# EAGLE design USB-Weather-v31 (EAGLE 5.11)
SFENUM: VREG-9872

## Sheet 1 of 2
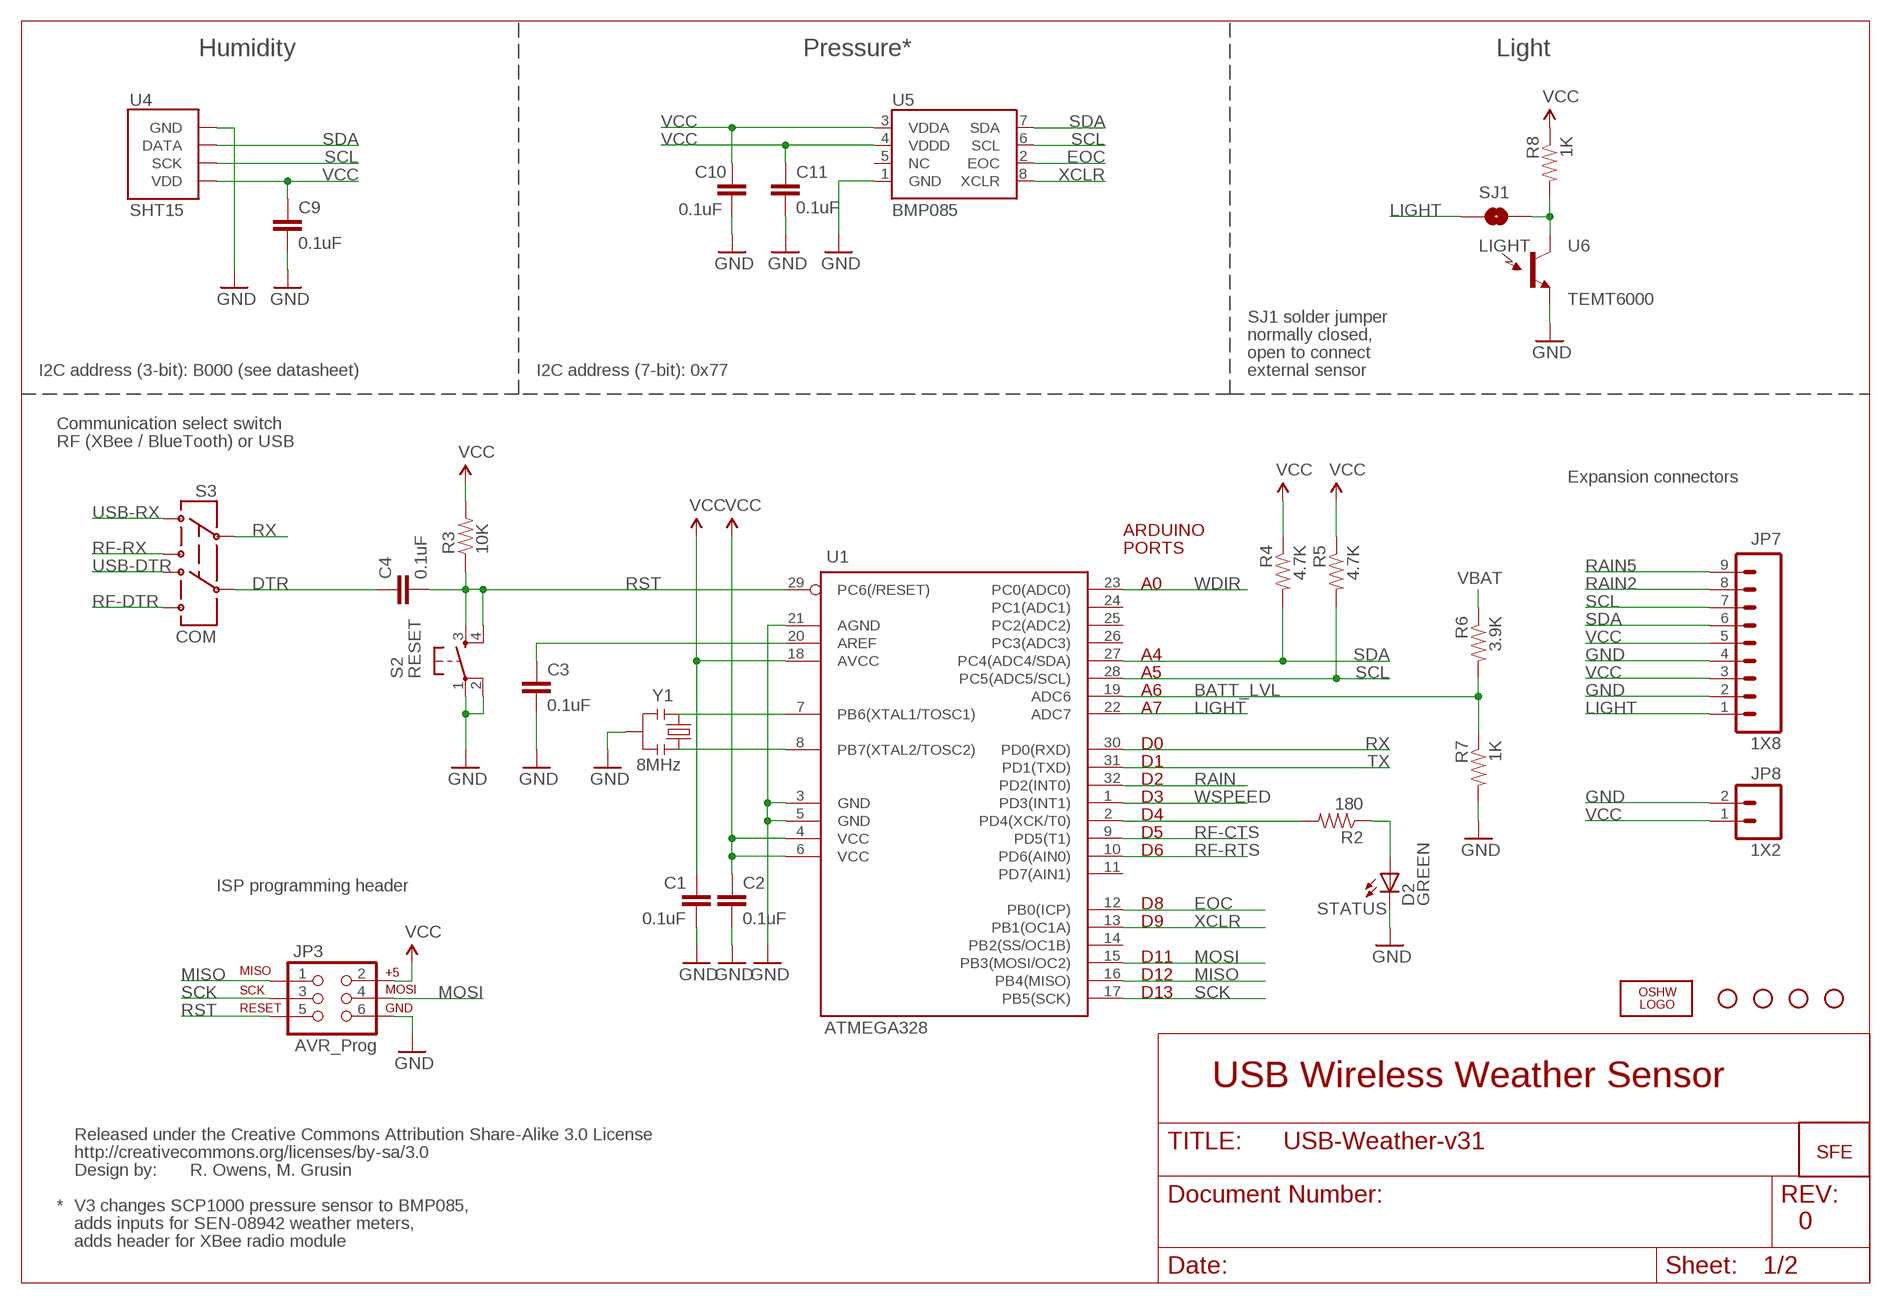
[diagram p0: schematic, sheet 1]

### Parts
C1  0.1uF  CAP0402-CAP  [0402-CAP]
C2  0.1uF  CAP0402-CAP  [0402-CAP]
C3  0.1uF  CAP0402-CAP  [0402-CAP]
C4  0.1uF  CAP0402-CAP  [0402-CAP]
C9  0.1uF  CAP0402-CAP  [0402-CAP]
C10  0.1uF  CAP0402-CAP  [0402-CAP]
C11  0.1uF  CAP0402-CAP  [0402-CAP]
D2  GREEN  LED0603  [LED-0603]
JP3  AVR_Prog  AVR_SPI_PRG_6PTH  [2X3]
JP7  1X8  M09  [1X09]
JP8  1X2  M02PTH  [1X02]
LOGO1  OSHW_LOGO_FILLX0100-NT  [OSHW_FILLX100_NOTEXT]
R2  180  RESISTOR0402-RES  [0402-RES]
R3  10K  RESISTOR0402-RES  [0402-RES]
R4  4.7K  RESISTOR0402-RES  [0402-RES]
R5  4.7K  RESISTOR0402-RES  [0402-RES]
R6  3.9K  RESISTOR0402-RES  [0402-RES]
R7  1K  RESISTOR0402-RES  [0402-RES]
R8  1K  RESISTOR0402-RES  [0402-RES]
S2  RESET  TAC_SWITCHSMD  [TACTILE_SWITCH_SMD]
S3  COM  SWITCH-DPDTSMD  [AYZ0202]
SJ1  LIGHT  SOLDERJUMPERNC  [SJ_2S]
U1  ATMEGA328  AVR-MEGA8-AI  [TQFP32-08]
U4  SHT15  SHT1XSMD  [SHT1X]
U5  BMP085  [BMP085]
U6  TEMT6000  [TEMT6000-SEN]
U$1  LOGO-SFENEW  [SFE-NEW-WEBLOGO]
U$2  STAND-OFF  [STAND-OFF]
U$3  STAND-OFF  [STAND-OFF]
U$4  STAND-OFF  [STAND-OFF]
U$5  STAND-OFF  [STAND-OFF]
U$6  CREATIVE_COMMONS  [CREATIVE_COMMONS]
Y1  8MHz  RESONATORSMD  [RESONATOR-SMD]

### Nets
BATT_LVL: R6.2 R7.1 U1.19(ADC6)
DTR: C4.1 S3.5
EOC: U1.12(PB0(ICP)) U5.2(EOC)
GND: C1.2 C2.2 C3.2 C9.2 C10.1 C11.2 D2.C JP3.6 JP7.2 JP7.4 JP8.2 R7.2 S2.1 S2.2 U1.3(GND) U1.5(GND) U1.21(AGND) U4.1(GND) U5.1(GND) U6.EMITTER(E1) Y1.2 ; also sheet 2
LIGHT: JP7.1 SJ1.1 U1.22(ADC7)
MISO: JP3.1 U1.16(PB4(MISO))
MOSI: JP3.4 U1.15(PB3(MOSI/OC2))
N$4: R2.2 U1.2(PD4(XCK/T0))
N$5: D2.A R2.1
N$8: C3.1 U1.20(AREF)
N$9: R8.2 SJ1.2 U6.COLLECTOR(C1)
N$10: U1.7(PB6(XTAL1/TOSC1)) Y1.1
N$14: U1.8(PB7(XTAL2/TOSC2)) Y1.3
RAIN: U1.32(PD2(INT0)) ; also sheet 2
RAIN2: JP7.8 ; also sheet 2
RAIN5: JP7.9 ; also sheet 2
RF-CTS: U1.9(PD5(T1)) ; also sheet 2
RF-DTR: S3.6 ; also sheet 2
RF-RTS: U1.10(PD6(AIN0)) ; also sheet 2
RF-RX: S3.3 ; also sheet 2
RST: C4.2 JP3.5 R3.1 S2.3 S2.4 U1.29(PC6(/RESET))
RX: S3.2 U1.30(PD0(RXD))
SCK: JP3.3 U1.17(PB5(SCK))
SCL: JP7.7 R5.2 U1.28(PC5(ADC5/SCL)) U4.3(SCK) U5.6(SCL)
SDA: JP7.6 R4.2 U1.27(PC4(ADC4/SDA)) U4.2(DATA) U5.7(SDA)
TX: U1.31(PD1(TXD)) ; also sheet 2
USB-DTR: S3.4 ; also sheet 2
USB-RX: S3.1 ; also sheet 2
VBAT: R6.1 ; also sheet 2
VCC: C1.1 C2.1 C9.1 C10.2 C11.1 JP3.2 JP7.3 JP7.5 JP8.1 R3.2 R4.1 R5.1 R8.1 U1.4(VCC) U1.6(VCC) U1.18(AVCC) U4.4(VDD) U5.3(VDDA) U5.4(VDDD) ; also sheet 2
WDIR: U1.23(PC0(ADC0)) ; also sheet 2
WSPEED: U1.1(PD3(INT1)) ; also sheet 2
XCLR: U1.13(PB1(OC1A)) U5.8(XCLR)
Unconnected: U1.11(PD7(AIN1)) U1.14(PB2(SS/OC1B)) U1.24(PC1(ADC1)) U1.25(PC2(ADC2)) U1.26(PC3(ADC3)) U5.5(NC)

### Notes on the sheet
- Humidity | Pressure* | Light
- SJ1 solder jumper
- normally closed,
- open to connect
- I2C address (3-bit): B000 (see datasheet) | I2C address (7-bit): 0x77 | external sensor
- Communication select switch
- RF (XBee / BlueTooth) or USB
- Expansion connectors
- ARDUINO
- PORTS
- A0
- A4
- A5
- A6
- A7
- D0
- D1
- D2
- D3
- D4
- D5
- D6
- ISP programming header
- D8
- STATUS
- D9
- D11
- D12
- D13
- USB Wireless Weather Sensor
- R. Owens, M. Grusin
- * | V3 changes SCP1000 pressure sensor to BMP085,
- adds inputs for SEN-08942 weather meters, | 0
- adds header for XBee radio module

## Sheet 2 of 2
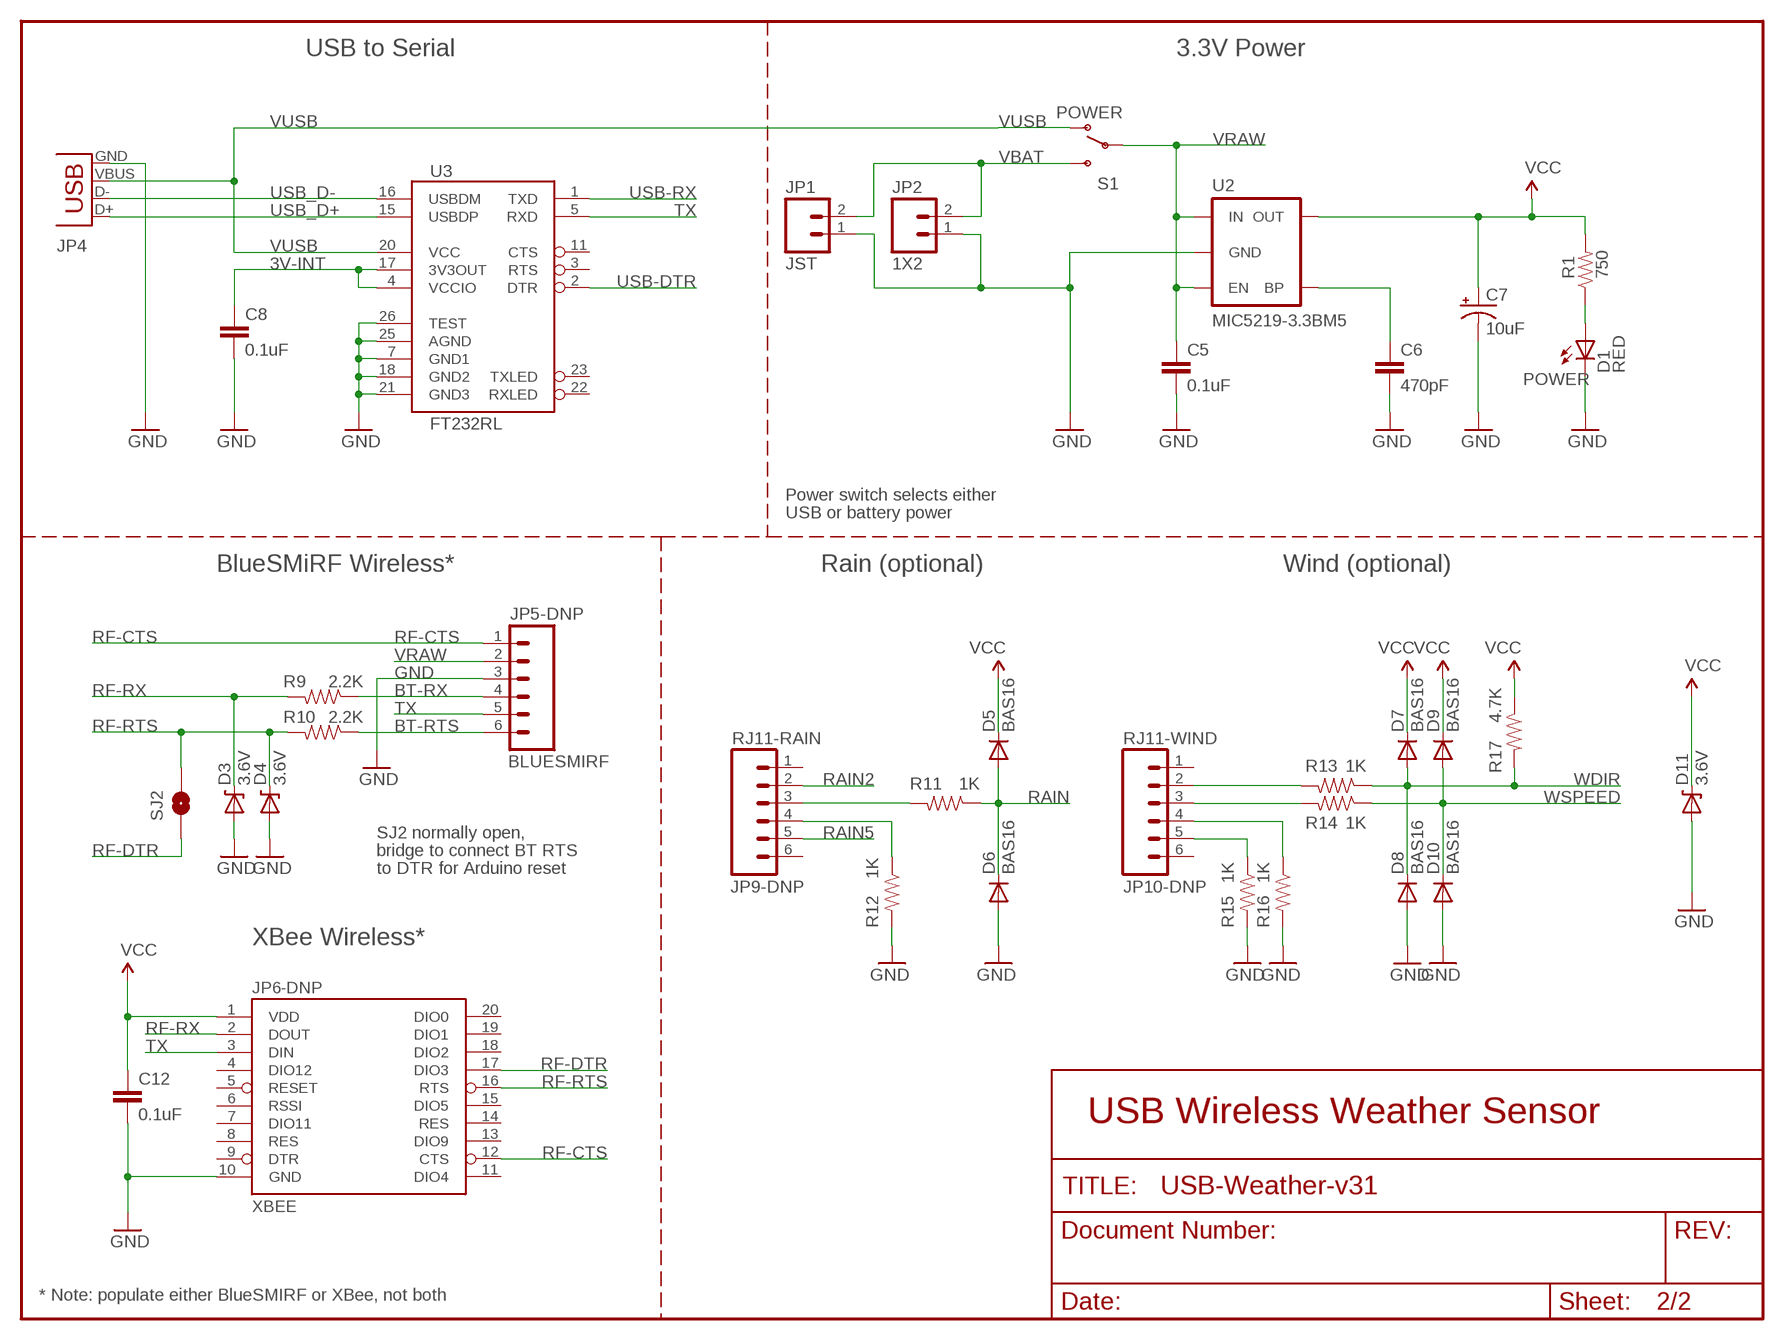
[diagram p1: schematic, sheet 2]

### Parts
C5  0.1uF  CAP0402-CAP  [0402-CAP]
C6  470pF  CAP0402-CAP  [0402-CAP]
C7  10uF  CAP_POL1206  [EIA3216]
C8  0.1uF  CAP0402-CAP  [0402-CAP]
C12  0.1uF  CAP0402-CAP  [0402-CAP]
D1  RED  LED0603  [LED-0603]
D3  3.6V  DIODE-ZENER-BZT52  [SOD-323]
D4  3.6V  DIODE-ZENER-BZT52  [SOD-323]
D5  BAS16  DIODESOD  [SOD-323]
D6  BAS16  DIODESOD  [SOD-323]
D7  BAS16  DIODESOD  [SOD-323]
D8  BAS16  DIODESOD  [SOD-323]
D9  BAS16  DIODESOD  [SOD-323]
D10  BAS16  DIODESOD  [SOD-323]
D11  3.6V  DIODE-ZENER-BZT52  [SOD-323]
JP1  JST  M02-JST-2MM-SMT  [JST-2-SMD]
JP2  1X2  M021X02_NO_SILK  [1X02_NO_SILK]
JP4  USBSMD  [USB-MINIB]
JP5-DNP  BLUESMIRF  M06SIP  [1X06]
JP6-DNP  XBEE  XBEE-1B1  [XBEE-1]
JP9-DNP  RJ11-RAIN  RJ11-6PTH  [RJ11-6]
JP10-DNP  RJ11-WIND  RJ11-6PTH  [RJ11-6]
R1  750  RESISTOR0402-RES  [0402-RES]
R9  2.2K  RESISTOR0402-RES  [0402-RES]
R10  2.2K  RESISTOR0402-RES  [0402-RES]
R11  1K  RESISTOR0402-RES  [0402-RES]
R12  1K  RESISTOR0402-RES  [0402-RES]
R13  1K  RESISTOR0402-RES  [0402-RES]
R14  1K  RESISTOR0402-RES  [0402-RES]
R15  1K  RESISTOR0402-RES  [0402-RES]
R16  1K  RESISTOR0402-RES  [0402-RES]
R17  4.7K  RESISTOR0402-RES  [0402-RES]
S1  POWER  SWITCH-SPSTSMD  [AYZ0202]
SJ2  SOLDERJUMPERNO  [SJ_2S-NO]
U2  MIC5219-3.3BM5  V_REG_LDOSMD  [SOT23-5]
U3  FT232RL  FT232RL-BASICSSOP  [SSOP28DB]

### Nets
3V-INT: C8.1 U3.4(VCCIO) U3.17(3V3OUT)
BT-RTS: JP5-DNP.6 R10.1
BT-RX: JP5-DNP.4 R9.1
GND: C5.2 C6.2 C7.C(-) C8.2 C12.2 D1.C D3.2(A) D4.2(A) D6.2(A) D8.2(A) D10.2(A) D11.2(A) JP1.1 JP2.1 JP4.GND JP5-DNP.3 JP6-DNP.10(GND) R12.2 R15.2 R16.2 U2.2(GND) U3.7(GND1) U3.18(GND2) U3.21(GND3) U3.25(AGND) U3.26(TEST) ; also sheet 1
N$1: D1.A R1.1
N$2: JP10-DNP.2 R13.2
N$3: JP10-DNP.3 R14.2
N$6: C6.1 U2.4(BP)
N$7: JP9-DNP.3 R11.2
N$11: JP9-DNP.4 R12.1
N$12: JP10-DNP.5 R15.1
N$13: JP10-DNP.4 R16.1
RAIN: D5.2(A) D6.1(C) R11.1 ; also sheet 1
RAIN2: JP9-DNP.2 ; also sheet 1
RAIN5: JP9-DNP.5 ; also sheet 1
RF-CTS: JP5-DNP.1 JP6-DNP.12(CTS) ; also sheet 1
RF-DTR: JP6-DNP.17(DIO3) SJ2.1 ; also sheet 1
RF-RTS: D4.1(C) JP6-DNP.16(RTS) R10.2 SJ2.2 ; also sheet 1
RF-RX: D3.1(C) JP6-DNP.2(DOUT) R9.2 ; also sheet 1
TX: JP5-DNP.5 JP6-DNP.3(DIN) U3.5(RXD) ; also sheet 1
USB-DTR: U3.2(DTR) ; also sheet 1
USB-RX: U3.1(TXD) ; also sheet 1
USB_D+: JP4.D+ U3.15(USBDP)
USB_D-: JP4.D- U3.16(USBDM)
VBAT: JP1.2 JP2.2 S1.3(S) ; also sheet 1
VCC: C7.A(+) C12.1 D5.1(C) D7.1(C) D9.1(C) D11.1(C) JP6-DNP.1(VDD) R1.2 R17.1 U2.5(OUT) ; also sheet 1
VRAW: C5.1 JP5-DNP.2 S1.2(P) U2.1(IN) U2.3(EN)
VUSB: JP4.VBUS S1.1(O) U3.20(VCC)
WDIR: D7.2(A) D8.1(C) R13.1 R17.2 ; also sheet 1
WSPEED: D9.2(A) D10.1(C) R14.1 ; also sheet 1
Unconnected: JP6-DNP.4(DIO12) JP6-DNP.5(RESET) JP6-DNP.6(RSSI) JP6-DNP.7(DIO11) JP6-DNP.8(RES) JP6-DNP.9(DTR) JP6-DNP.11(DIO4) JP6-DNP.13(DIO9) JP6-DNP.14(RES) JP6-DNP.15(DIO5) JP6-DNP.18(DIO2) JP6-DNP.19(DIO1) JP6-DNP.20(DIO0) JP9-DNP.1 JP9-DNP.6 JP10-DNP.1 JP10-DNP.6 U3.3(RTS) U3.11(CTS) U3.22(RXLED) U3.23(TXLED)

### Notes on the sheet
- USB to Serial | 3.3V Power
- JP4
- POWER
- Power switch selects either
- USB or battery power
- Rain (optional) | Wind (optional)
- BlueSMiRF Wireless*
- SJ2 normally open,
- bridge to connect BT RTS
- to DTR for Arduino reset
- XBee Wireless*
- USB Wireless Weather Sensor
- * Note: populate either BlueSMIRF or XBee, not both

## Library data of the parts
C1-C6 C8-C12 = SparkFun:CAP: Capacitor Standard 0603 ceramic capacitor, and 0.1" leaded capacitor.
C7 = SparkFun:CAP_POL: Capacitor Polarized These are standard SMD and PTH capacitors. Normally 10uF, 47uF, and 100uF in electrolytic and tantalum varieties. Always verify the external diameter of the through hole cap, it varies with capacity, voltage, and manufacturer. The EIA devices should be standard.
D1 D2 = SparkFun:LED: LEDs Standard schematic elements and footprints for 5mm, 3mm, 1206, and 0603 sized LEDs. 5mm - Spark Fun Electronics SKU : COM-00529 (and others)
D3 D4 D11 = SparkFun:DIODE-ZENER: Zener Diode Production Part - 8199 3.4V Zener Voltage
D5-D10 = SparkFun:DIODE: Diode These are standard reverse protection diodes and small signal diodes. SMA package can handle up to about 1A. SOD-323 can handle about 200mA. What the SOD-323 package when ordering, there are some mfgs out there that are 5-pin packages.
JP1 JP2 JP8 = SparkFun:M02: Header 2 Standard 2-pin 0.1" header. Use with straight break away headers (SKU : PRT-00116), right angle break away headers (PRT-00553), swiss pins (PRT-00743), machine pins (PRT-00117), and female headers (PRT-00115). Molex polarized connector foot print use with SKU : PRT-08233 with associated crimp pins and housings.
JP3 = SparkFun:AVR_SPI_PRG_6: AVR ISP 6 Pin This is the reduced ISP connector for AVR programming. Common on Arduino. This footprint will take up less PCB space and can be used with a 10-pin to 6-pin adapter such as SKU: BOB-08508
JP4 = SparkFun:USB: USB Connectors USB-B-PTH is fully proven SKU : PRT-00139 USB-miniB is fully proven SKU : PRT-00587 USB-A-PCB is untested. USB-A-H is throughly reviewed, but untested. Spark Fun Electronics SKU : PRT-00437 USB-B-SMT is throughly reviewed, but untested. Needs silkscreen touching up. USB-A-S has not been used/tested USB-MB-H has not been used/tested
JP5-DNP = SparkFun:M06: Header 6 Standard 6-pin 0.1" header. Use with straight break away headers (SKU : PRT-00116), right angle break away headers (PRT-00553), swiss pins (PRT-00743), machine pins (PRT-00117), and female headers (PRT-00115). Molex polarized connector foot print use with SKU : PRT-08094 with associated crimp pins and housings. NOTES ON THE VARIANTS LOCK and LOCK_LONGPADS... This footprint was designed to help hold the alignment of a through-hole component (i.e. 6-pin header) while soldering it into place. You may notice that each hole has been shifted either up or down by 0.005 of an inch from it's more standard position (which is a perfectly straight line). This slight alteration caused the pins (the squares in the middle) to touch the edges of the holes. Because they are alternating, it causes a "brace" to hold the component in place. 0.005 has proven to be the perfect amount of "off-center" position when using our standard breakaway headers. Although looks a little odd when you look at the bare footprint, once you have a header in there, the alteration is very hard to notice. Also, if you push a header all the way into place, it is covered up entirely on the bottom side. This idea of altering the position of holes to aid alignment will be further integrated into the Sparkfun Library for other footprints. It can help hold any component with 3 or more connection pins.
JP6-DNP = SparkFun:XBEE-1
JP7 = SparkFun:M09: Header 9 Standard 9-pin 0.1" header. Use with straight break away headers (SKU : PRT-00116), right angle break away headers (PRT-00553), swiss pins (PRT-00743), machine pins (PRT-00117), and female headers (PRT-00115).
JP9-DNP JP10-DNP = SparkFun:RJ11-6: RJ11 Jack Simple 6 pin RJ11 jack. Commonly found on CAT3 devices and Microchip programmers. SKU: PRT-00132
LOGO1 = OSHW:OSHW_LOGO_FILL
R1-R17 = SparkFun:RESISTOR: Resistor Basic schematic elements and footprints for 0603, 1206, and PTH resistors.
S1 = SparkFun:SWITCH-SPST: SPST Switch Simple slide switch. Spark Fun Electronics SKU : COM-00102
S2 = SparkFun:TAC_SWITCH: Momentary Switch Button commonly used for reset or general input. Spark Fun Electronics SKU : COM-00097
S3 = SparkFun:SWITCH-DPDT: DPDT Version of the COM-00597
SJ1 SJ2 = SparkFun:SOLDERJUMPER: Solder Jumper Standard SMD solder jumper. Used to automate production. Two varients : Normally Open and Normally Closed are the same, but have different paste layers. NC will have a large amount of paste and should jumper during reflow.
U1 = SparkFun:AVR-MEGA8: MICROCONTROLLER 8 Kbytes FLASH 1 kbytes SRAM 512 bytes EEPROM USART 6-channel 10 bit ADC 2-channel 8 bit ADC
U2 = SparkFun:V_REG_LDO: Voltage Regulator LDO Standard 150mA LDO voltage regulator in SOT-23 layout. Micrel part MIC5205. BP (by-pass) pin is used to lower output noise with 470pF cap.
U3 = SparkFun:FT232RL-BASIC: USB UART This is the simplified version of the FT232RL unit. Only what you need, nothing you don't. Spark Fun Electronics SKU : COM-00650
U4 = SparkFun:SHT1X: SHT1x Humdity Sensor Sensirion humdity sensor. Schematic element and footprint proven. Spark Fun Electronics SKU : COM-08227
U5 = SparkFun:BMP085: BMP085 Pressure Sensor Great little MEMS pressure sensor. SKU: COM-09603
U6 = SparkFun:TEMT6000: Ambient Light Sensor Simple light detection sensor. Output varies with light intensity input. Spark Fun Electronics SKU : COM-08348
U$1 = SparkFun:LOGO-SFE: Spark Fun Electronics PCB Logo This is the standard Spark Fun Electronics PCB logo.
U$2-U$5 = SparkFun:STAND-OFF: Stand Off This is the mechanical footprint for a #4 phillips button head screw. Use the keepout ring to avoid running the screw head into surrounding components. SKU : PRT-00447
U$6 = SparkFun:CREATIVE_COMMONS
Y1 = SparkFun:RESONATOR: Resonator Small SMD resonator. This is the itty bitty 10/20MHz resonators with built in caps. CSTCE10M0G55 and CSTCE20M0V53. Footprint has been reviewed closely but hasn't been tested yet.

## Net classes
0 Default: width 0.203 mm
1 Power: width 0.305 mm

## Board
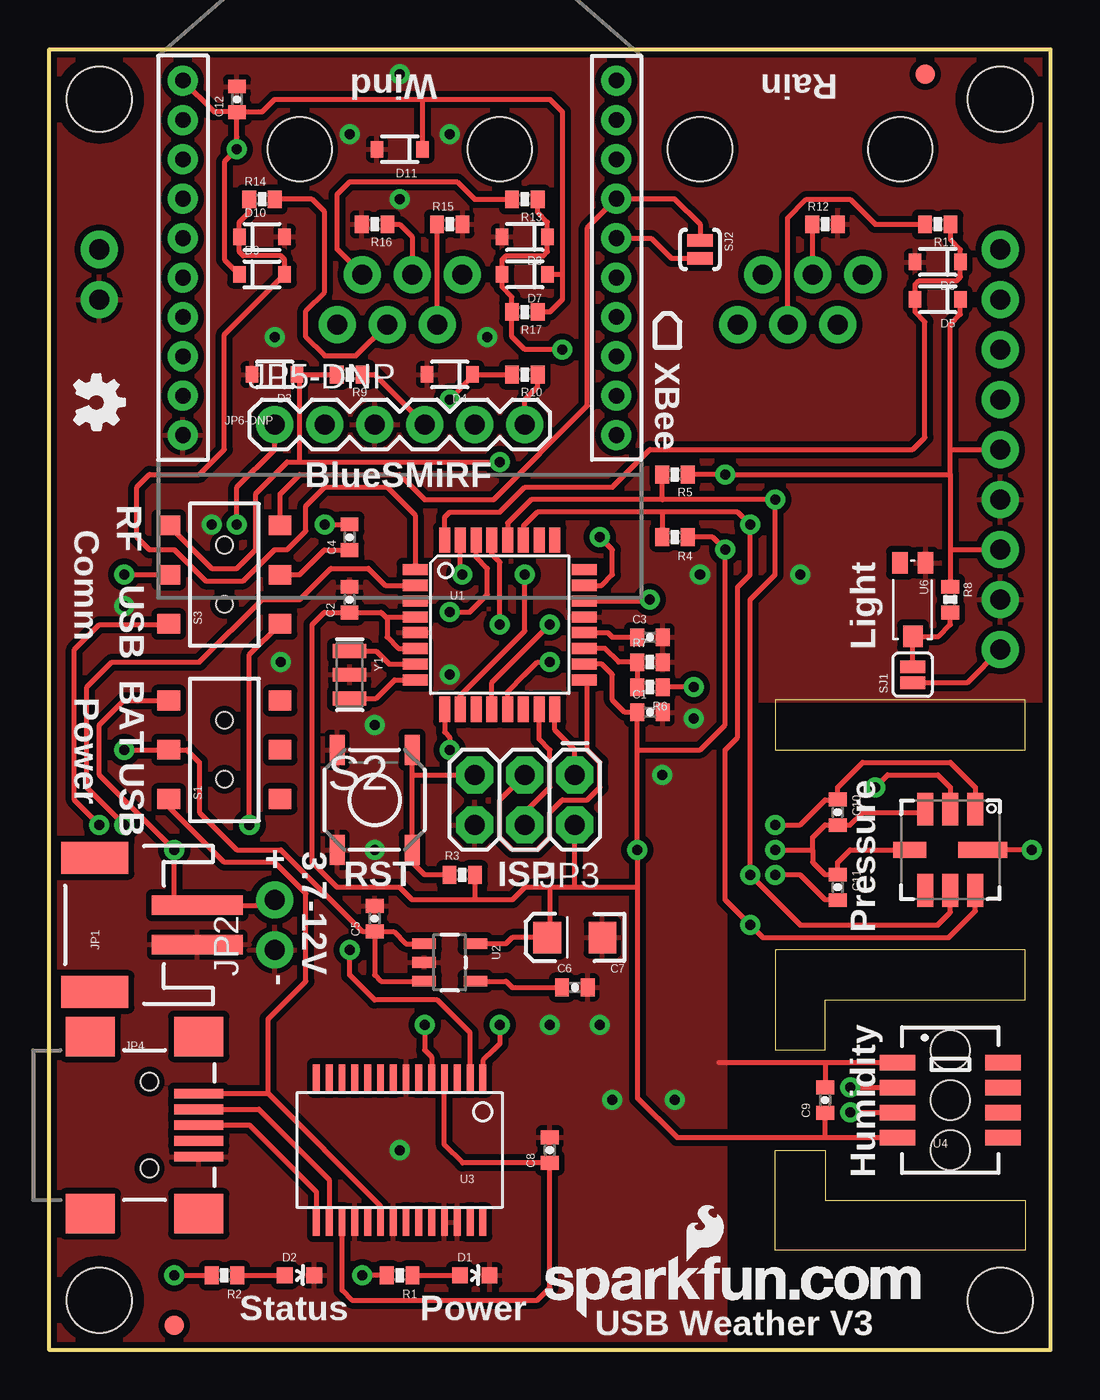
[diagram p2: board, top side]
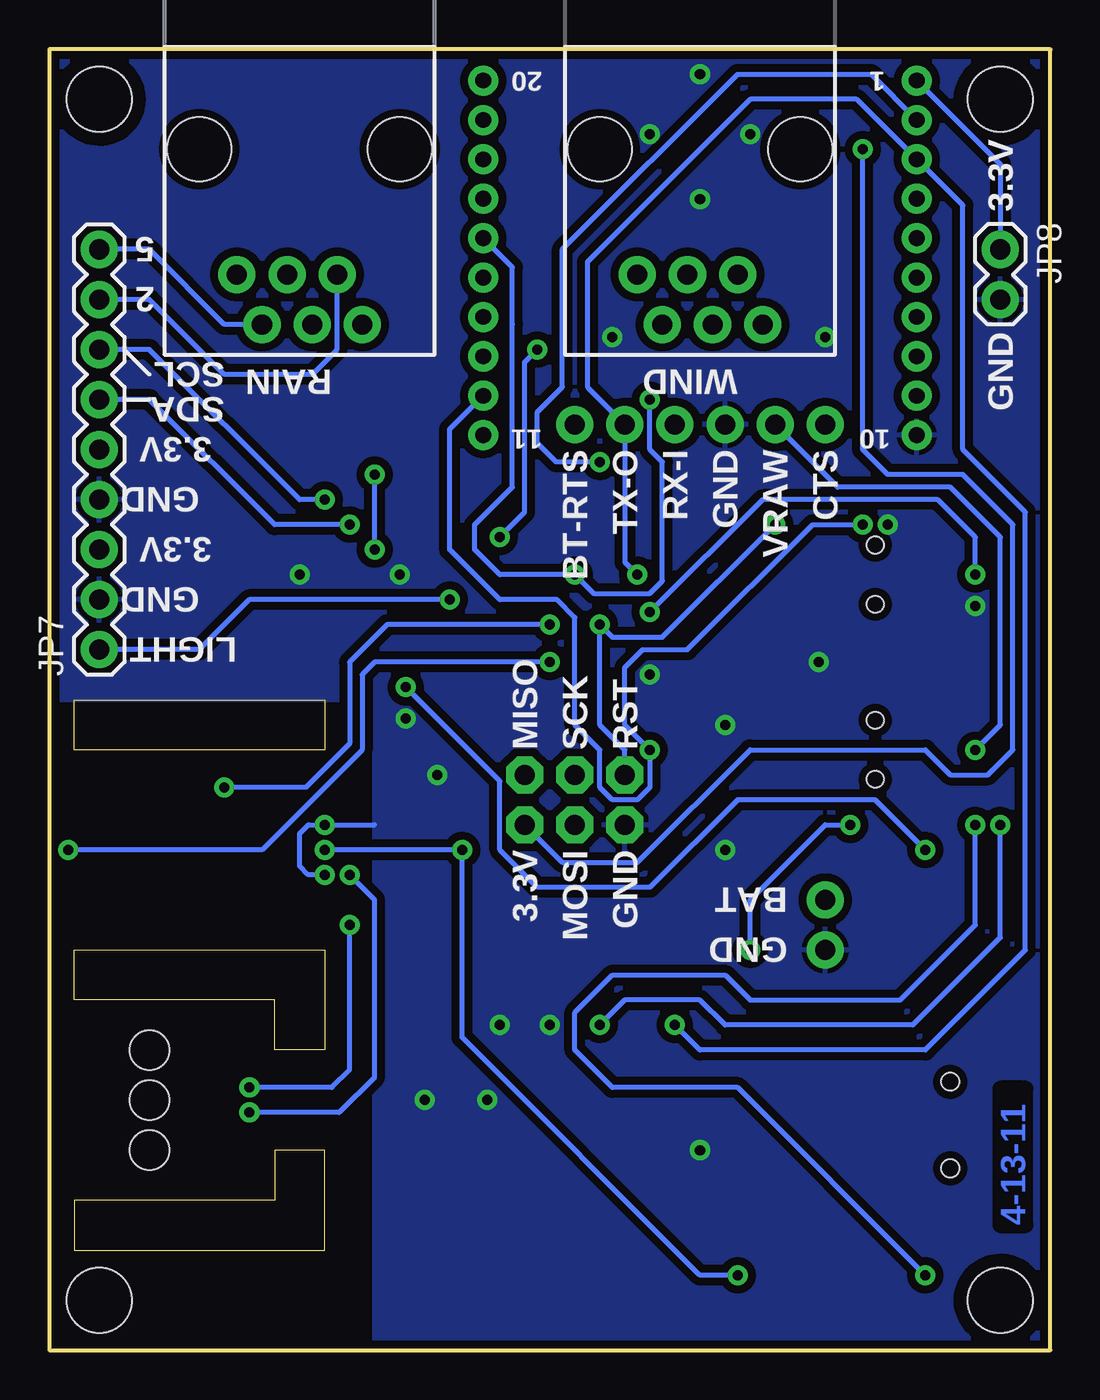
[diagram p3: board, bottom side, seen from below]

Size 50.8 x 66.04 mm. Coordinates in mm from the lower left corner, seen from the top.
Outline: 0,66.04 50.8,66.04 50.8,0 0,0 0,66.04
Copper layers (1*16): Top 0.035mm / dielectric 1.5mm / Bottom 0.035mm
Design rules "SparkFun *": minimum track width 8mil, minimum drill 20mil, track to track 8mil, track to pad 8mil, pad to pad 8mil, via to via 8mil, smd to smd 8mil, copper to edge 8mil, drill to drill 8mil, minimum pad ring 12mil, minimum via ring 10mil, stop-mask expansion 4mil, vias tented up to drill 20mil, thermal gap 10mil
Holes 2 mm at 45.72,15.24 45.72,12.7 45.72,10.16
Milling: area 36.8,15.2 to 49.5,20.3; area 36.8,5.1 to 49.5,10.2; area 36.8,30.5 to 49.5,33

### Footprints (pad centres in the part's own frame; a part is rotated, then mirrored left to right if it is on the bottom)
0402-CAP = smd 0.7 x 0.9: 1 -0.65,0; 2 0.65,0
EIA3216 = smd 1.4 x 1.6: A 1.4,0; C -1.4,0
LED-0603 = smd 0.8 x 0.8: A 0,-0.75; C 0,0.75
SOD-323 = smd 0.63 x 0.83: 1 -1.15,0; 2 1.15,0
FIDUCIAL-1X2 = smd 1 x 1: 1 0,0
JST-2-SMD = smd 1 x 4.6: 1 -1,-3.7; 2 1,-3.7 | smd 1.6 x 3.4: NC1 -3.4,1.5; NC2 3.4,1.5
1X02_NO_SILK = drill 1.016 pad 1.88 round: 1 0,0; 2 2.54,0
2X3 = drill 1.016 pad 1.88 octagon: 1 0,0; 2 0,2.54; 3 2.54,0; 4 2.54,2.54; 5 5.08,0; 6 5.08,2.54
USB-MINIB = smd 2.5 x 0.5: D+ 2.5,0; D- 2.5,0.8; GND 2.5,-1.6; ID 2.5,-0.8; VBUS 2.5,1.6 | smd 2.5 x 2: MTN1 -3,4.5; MTN2 2.5,4.5; MTN3 -3,-4.5; MTN4 2.5,-4.5 | hole 0.9: 0,2.2; 0,-2.2
1X06 = drill 1.016 pad 1.88 round: 1 0,0; 2 2.54,0; 3 5.08,0; 4 7.62,0; 5 10.16,0; 6 12.7,0
XBEE-1 = drill 0.8 pad 1.524 round: 1 -11,20; 2 -11,18; 3 -11,16; 4 -11,14; 5 -11,12; 6 -11,10; 7 -11,8; 8 -11,6; 9 -11,4; 10 -11,2; 11 11,2; 12 11,4; 13 11,6; 14 11,8; 15 11,10; 16 11,12; 17 11,14; 18 11,16; 19 11,18; 20 11,20
1X09 = drill 1.016 pad 1.88 round: 1 0,0; 2 2.54,0; 3 5.08,0; 4 7.62,0; 5 10.16,0; 6 12.7,0; 7 15.24,0; 8 17.78,0; 9 20.32,0
1X02 = drill 1.016 pad 1.88 round: 1 0,0; 2 2.54,0
RJ11-6 = drill 1.016 pad 1.88 round: 1 1.905,8.89; 2 3.175,6.35; 3 4.445,8.89; 4 5.715,6.35; 5 6.985,8.89; 6 8.255,6.35 | hole 3.251: 0,0; 10.16,0
0402-RES = smd 0.7 x 0.9: 1 -0.65,0; 2 0.65,0
AYZ0202 = smd 1 x 1.15: 1 -2.5,2.825; 2 0,2.825; 3 2.5,2.825; 4 -2.5,-2.825; 5 0,-2.825; 6 2.5,-2.825 | hole 0.85: 1.5,0; -1.5,0
TACTILE_SWITCH_SMD = smd 1.524 x 0.762: 1 -2.54,1.905; 2 2.54,1.905; 3 -2.54,-1.905; 4 2.54,-1.905
SJ_2S = smd 0.635 x 1.27: 1 -0.412,0; 2 0.412,0
SJ_2S-NO = smd 0.635 x 1.27: 1 -0.45,0; 2 0.45,0
TQFP32-08 = smd 1.27 x 0.559: 1 -4.293,2.8; 2 -4.293,2; 3 -4.293,1.2; 4 -4.293,0.4; 5 -4.293,-0.4; 6 -4.293,-1.2; 7 -4.293,-2; 8 -4.293,-2.8; 17 4.293,-2.8; 18 4.293,-2; 19 4.293,-1.2; 20 4.293,-0.4; 21 4.293,0.4; 22 4.293,1.2; 23 4.293,2; 24 4.293,2.8 | smd 0.559 x 1.27: 9 -2.8,-4.293; 10 -2,-4.293; 11 -1.2,-4.293; 12 -0.4,-4.293; 13 0.4,-4.293; 14 1.2,-4.293; 15 2,-4.293; 16 2.8,-4.293; 25 2.8,4.293; 26 2,4.293; 27 1.2,4.293; 28 0.4,4.293; 29 -0.4,4.293; 30 -1.2,4.293; 31 -2,4.293; 32 -2.8,4.293
SOT23-5 = smd 0.55 x 1.2: 1 -0.95,-1.3; 2 0,-1.3; 3 0.95,-1.3; 4 0.95,1.3; 5 -0.95,1.3
SSOP28DB = smd 0.348 x 1.397: 1 -4.225,-3.656; 2 -3.575,-3.656; 3 -2.925,-3.656; 4 -2.275,-3.656; 5 -1.625,-3.656; 6 -0.975,-3.656; 7 -0.325,-3.656; 8 0.325,-3.656; 9 0.975,-3.656; 10 1.625,-3.656; 11 2.275,-3.656; 12 2.925,-3.656; 13 3.575,-3.656; 14 4.225,-3.656; 15 4.225,3.656; 16 3.575,3.656; 17 2.925,3.656; 18 2.275,3.656; 19 1.625,3.656; 20 0.975,3.656; 21 0.325,3.656; 22 -0.325,3.656; 23 -0.975,3.656; 24 -1.625,3.656; 25 -2.275,3.656; 26 -2.925,3.656; 27 -3.575,3.656; 28 -4.225,3.656
SHT1X = smd 1.8 x 0.8: 1 -2.667,1.905; 2 -2.667,0.635; 3 -2.667,-0.635; 4 -2.667,-1.905; 5 2.667,-1.905; 6 2.667,-0.635; 7 2.667,0.635; 8 2.667,1.905
BMP085 = smd 1.67 x 0.8: 1 -2.065,1.27; 2 -2.065,0; 3 -2.065,-1.27; 5 2.065,-1.27; 6 2.065,0; 7 2.065,1.27 | smd 0.8 x 1.67: 4 0,-2.065 | smd 0.8 x 2.5: 8 0,1.65
TEMT6000-SEN = smd 1.1 x 0.8: BASE -1.87,-0.65; EMITTER -1.87,0.65 | smd 1.1 x 1: COLLECTOR 1.86,0.01
STAND-OFF = hole 3.302: 0,0
RESONATOR-SMD = smd 0.7 x 1.7: 1 -1.2,0; 2 0,0; 3 1.2,0

### Placement (x,y rotation side)
C1  30.48,32.38 0 top
C2  15.24,38.1 90 top
C3  30.48,36.2 0 top
C4  15.24,41.27 90 top
C5  16.51,21.91 90 top
C6  26.67,18.41 0 top
C7  26.67,20.95 180 top
C8  25.4,10.16 90 top
C9  39.37,12.7 90 top
C10  40.01,27.3 270 top
C11  40.01,23.5 270 top
C12  9.53,63.5 90 top
D1  21.59,3.81 270 top
D2  12.7,3.81 270 top
D3  11.43,49.53 180 top
D4  20.32,49.53 180 top
D5  45.09,53.34 180 top
D6  45.09,55.24 180 top
D7  24.13,54.61 180 top
D8  24.13,56.52 180 top
D9  10.79,54.61 0 top
D10  10.79,56.52 0 top
D11  17.78,60.96 180 top
E$1  [FIDUCIAL-1X2]  44.45,64.77 0 top
E$2  [FIDUCIAL-1X2]  6.35,1.27 0 top
JP1  3.81,21.59 90 top
JP2  11.43,20.32 90 top
JP3  26.67,29.21 180 top
JP4  5.08,11.43 0 top
JP5-DNP  11.43,46.99 0 top
JP6-DNP  17.78,44.45 0 top
JP7  48.26,35.56 90 bottom
JP8  2.54,55.88 270 bottom
JP9-DNP  33.02,60.96 180 bottom
JP10-DNP  12.7,60.96 180 bottom
LOGO1  1.27,49.53 270 top
R1  17.78,3.81 180 top
R2  8.89,3.81 180 top
R3  20.95,24.13 0 top
R4  31.75,41.27 180 top
R5  31.75,44.45 180 top
R6  30.48,33.66 180 top
R7  30.48,34.92 0 top
R8  45.72,38.1 270 top
R9  15.24,49.53 180 top
R10  24.13,49.53 180 top
R11  45.09,57.15 180 top
R12  39.37,57.15 0 top
R13  24.13,58.42 180 top
R14  10.79,58.42 0 top
R15  20.32,57.15 0 top
R16  16.51,57.15 180 top
R17  24.13,52.7 180 top
S1  8.89,30.48 90 top
S2  16.51,27.94 90 top
S3  8.89,39.37 90 top
SJ1  43.81,34.29 90 top
SJ2  33.02,55.88 270 top
U1  22.86,36.83 0 top
U2  20.32,19.68 270 top
U3  17.78,10.16 180 top
U4  45.72,12.7 0 top
U5  45.72,25.4 270 top
U6  43.81,38.1 270 top
U$1  25.15,1.65 0 top
U$2  2.54,2.54 0 top
U$3  48.26,2.54 0 top
U$4  2.54,63.5 0 top
U$5  48.26,63.5 0 top
U$6  -5.08,-12.7 0 top  (outside the outline)
Y1  15.24,34.29 270 top

### Tracks (layer width: path | path; a pad name or v marks a point on that pad's centre or on a via)
3V-INT
  Top 0.254: U3.17 14.86,3.04 15.35,2.54 24.77,2.54 25.4,3.17 C8.1 20.97,9.51 20.05,10.43 U3.4
BATT_LVL
  Top 0.254: U1.19 28.19,35.63 28.89,34.92 R7.1 29.84,34.92 R7.1 R6.2
BT-RTS
  Top 0.254: R10.1 24.78,48.91 24.13,48.26 JP5-DNP.6
BT-RX
  Top 0.254: R9.1 16.51,49.53 JP5-DNP.4
DTR
  Top 0.254: S3.5 12.7,39.37 13.96,40.62 C4.1
EOC  (via drill 0.51)
  Top 0.254: U5.2 45.72,28.57 45.09,29.21 42.55,29.21 v41.91,28.57 | U1.12 22.46,33.89 v25.4,36.83
  Bottom 0.254: v25.4,36.83 33.66,36.83 35.56,34.92 35.56,30.8 37.78,28.57 v41.91,28.57
GND  (via drill 0.51)
  Top 0.254: U5.1 46.99,28.57 45.72,29.84 41.27,29.84 40.01,28.57 C10.1 39.37,27.94 38.1,26.67 v36.83,26.67 | C11.2 39.99,22.86 39.37,22.86 38.1,24.13 v36.83,24.13 | 39.37,14.61 U4.1 | 33.97,14.61 39.37,14.61 | 39.37,14.61 C9.2
  Bottom 0.254: 34.29,26.67 v36.83,26.67 37.65,26.67 38.1,26.22 38.1,24.58 37.65,24.13 v36.83,24.13
  other vias: 16.51,31.75 11.43,51.44 20.32,61.72 32.7,32.07 25.4,16.51 16.51,25.4 17.78,10.16 28.57,12.7 20.32,34.29 27.94,16.51 3.81,37.78 31.11,29.21 38.1,39.37 33.02,39.37 15.24,61.72 22.23,51.44 17.78,58.42 17.78,64.77 8.26,41.91 31.75,12.7 11.75,34.92
  pour Bottom (isolate 0.406): 34.29,0 34.29,33.02 50.8,33.02 50.8,66.04 0,66.04 0,0
  pour Top (isolate 0.305): 34.29,0 34.29,33.02 50.8,33.02 50.8,66.04 0,66.04 0,0
LIGHT  (via drill 0.51)
  Top 0.254: U1.22 30.41,38.03 v30.48,38.1 | SJ1.1 46.58,33.88 JP7.1
  Bottom 0.254: v30.48,38.1 40.64,38.1 43.18,35.56 JP7.1
MISO
  Top 0.254: U1.16 25.66,31.49 26.67,30.48 JP3.1
MOSI
  Top 0.254: JP3.4 24.13,27.3 25.4,28.57 25.4,30.48 24.86,31.02 U1.15
N$1
  Top 0.254: R1.1 D1.A
N$2
  Top 0.254: JP10-DNP.2 14.61,55.88 14.61,56.01 14.61,58.67 15.24,59.31 20.7,59.31 21.59,58.42 R13.2
N$3
  Top 0.254: R14.2 11.43,58.41 | JP10-DNP.3 15.56,50.48 13.97,50.48 13.02,51.44 13.02,52.77 13.97,53.72 13.97,57.78 13.34,58.42 R14.2 | R14.2 11.43,58.42
N$4  (via drill 0.51)
  Top 0.254: U1.2 17.05,38.83 16.19,39.69 14.29,39.69 12.7,38.1 10.79,38.1 7.62,34.92 3.17,34.92 1.91,33.66 1.91,28.57 v3.81,26.67 | 8.26,3.81 R2.2 v6.35,3.81
  Bottom 0.254: v6.35,3.81 15.88,13.34 22.23,13.34 24.13,15.24 24.13,17.14 22.23,19.05 16.51,19.05 15.24,17.78 7.62,17.78 3.81,21.59 v3.81,26.67
N$5
  Top 0.254: R2.1 D2.A
N$6
  Top 0.254: U2.4 23.18,18.73 23.5,18.41 C6.1
N$7
  Top 0.254: JP9-DNP.3 37.47,57.47 38.42,58.42 40.64,58.42 41.91,57.15 R11.2
N$8
  Top 0.254: U1.20 28.34,36.43 28.57,36.2 C3.1
N$9
  Top 0.254: SJ1.2 43.83,34.71 U6.COLLECTOR 45.13,36.24 45.72,36.83 R8.2
N$10
  Top 0.254: U1.7 17.24,34.83 16.58,35.49 Y1.1
N$11
  Top 0.254: JP9-DNP.4 38.73,57.13 R12.1
N$12
  Top 0.254: JP10-DNP.5 19.68,57.15 R15.1
N$13
  Top 0.254: R16.1 17.78,57.15 18.41,56.52 JP10-DNP.4
N$14
  Top 0.254: U1.8 17.52,34.03 16.58,33.09 Y1.3
RAIN
  Top 0.254: U1.32 20.06,42.28 20.32,42.55 22.86,42.55 24.13,43.81 28.57,43.81 30.48,45.72 43.81,45.72 44.44,46.34 44.44,52.21 43.94,52.71 D5.2 43.94,54.09 44.13,54.29 46.04,54.29 46.23,54.48 D6.1 46.23,55.87 45.73,56.37 R11.1 45.72,57.13
RAIN2
  Bottom 0.254: JP9-DNP.2 36.2,50.8 37.47,49.53 41.91,49.53 45.72,53.34 JP7.8
RAIN5
  Bottom 0.254: JP9-DNP.5 41.91,52.07 45.72,55.88 JP7.9
RF-CTS  (via drill 0.51)
  Top 0.254: JP5-DNP.1 11.43,45.72 9.53,43.81 v9.53,41.91 | U1.9 20.06,31.38 20.32,31.11 v20.32,30.48
  Bottom 0.254: v9.53,41.91 12.06,41.91 18.41,35.56 20.69,35.56 21.59,34.66 21.59,31.75 v20.32,30.48 20.32,28.57 20.95,27.94 22.23,27.94 22.86,28.57 22.86,30.48 24.13,31.75 24.13,37.2 25.03,38.1 27.94,38.1 30.48,40.64 30.48,46.75 JP6-DNP.12
RF-DTR
  Top 0.254: S3.6 11.71,43.47 12.7,44.45 17.78,44.45 19.05,43.18 22.54,43.18 27.3,47.94 27.3,56.98 JP6-DNP.17 31.72,58.45 33.02,57.15 SJ2.1
RF-RTS  (via drill 0.51)
  Top 0.254: R10.2 D4.1 21.47,49.41 v20.32,48.26 | v24.13,39.37 24.13,36.51 20.86,33.24 U1.10 | SJ2.2 31.57,55.43 31.11,55.88 30.55,56.45 JP6-DNP.16
  Bottom 0.254: v20.32,48.26 20.32,45.72 19.68,45.09 19.68,39.05 20.32,38.42 23.18,38.42 v24.13,39.37 27.94,39.37 29.21,40.64 29.21,41.91 27.3,43.81 27.3,52.07 27.3,54.98 JP6-DNP.16
RF-RX  (via drill 0.51)
  Top 0.254: 12.7,45.09 12.06,45.09 10.48,43.5 10.48,40.64 9.53,39.69 8.26,39.69 S3.3 | 12.7,45.09 v22.86,45.09 | 12.7,45.09 12.7,49.53 D3.1 R9.2
  Bottom 0.254: JP6-DNP.2 9.1,64.77 15.88,64.77 24.77,55.88 24.77,48.9 26.04,47.62 26.04,46.04 25.08,45.09 v22.86,45.09
RST  (via drill 0.51)
  Top 0.254: S2.3 18.4,25.39 | S2.3 18.41,27.3 18.41,29.21 | 18.41,29.21 S2.4 | S2.3 18.41,24.78 18.41,24.77 19.05,24.13 R3.1 | U1.29 22.46,40.41 22.86,40.01 v22.86,36.83 | C4.2 15.22,41.91 v13.97,41.91 | 18.41,29.21 JP3.5
  Bottom 0.254: JP3.5 21.59,30.48 22.86,31.75 v22.86,36.83 22.23,36.2 19.68,36.2 v13.97,41.91
RX  (via drill 0.51)
  Top 0.254: 6.35,39.37 S3.2 v3.81,39.37 | U1.30 21.66,40.25 22.23,39.69 22.23,38.36 21.33,37.47 v20.32,37.47
  Bottom 0.254: v3.81,39.37 3.81,41.27 5.71,43.18 14.61,43.18 v20.32,37.47
SCK
  Top 0.254: JP3.3 22.86,27.94 22.86,26.04 23.5,25.4 24.77,25.4 25.4,26.04 25.4,27.3 26.04,27.94 27.3,27.94 27.94,28.57 27.94,29.84 27.3,30.48 27.3,34.04 27.3,34.03 U1.17
SCL  (via drill 0.51)
  Top 0.254: 45.72,23.5 U5.6 45.72,22.23 45.09,21.59 38.1,21.59 v35.56,24.13 35.56,38.1 36.83,39.37 v36.83,43.18 31.11,43.18 | 31.11,43.18 31.11,44.45 R5.2 | 31.11,43.18 24.45,43.18 23.26,41.99 U1.28 | v40.64,12.06 U4.3
  Bottom 0.254: v35.56,24.13 34.29,22.86 34.29,13.86 36.09,12.06 v40.64,12.06 | v36.83,43.18 38.1,43.18 45.72,50.8 JP7.7
SDA  (via drill 0.51)
  Top 0.254: 46.99,23.5 U5.7 46.99,22.3 45.65,20.95 36.2,20.95 v35.56,21.59 34.29,22.86 34.29,30.48 34.92,31.11 34.92,38.73 35.56,39.37 v35.56,41.91 34.92,42.55 31.11,42.55 | 31.11,42.55 24.77,42.55 24.06,41.84 U1.27 | 31.11,42.55 31.11,41.27 R4.2 | v40.64,13.34 U4.2
  Bottom 0.254: v40.64,13.34 36.46,13.34 35.56,14.23 v35.56,21.59 | v35.56,41.91 39.37,41.91 45.72,48.26 JP7.6
TX  (via drill 0.51)
  Top 0.254: U1.31 20.86,39.47 v20.95,39.37 | U3.5 19.41,14.88 19.05,15.24 v19.05,16.51
  Bottom 0.254: v19.05,16.51 17.78,15.24 6.35,15.24 1.27,20.32 1.27,42.55 4.45,45.72 4.45,58.12 JP6-DNP.3 9.83,63.5 15.24,63.5 23.5,55.24 23.5,48.9 JP5-DNP.5 21.59,40.01 v20.95,39.37
USB-DTR  (via drill 0.51)
  Top 0.254: S3.4 10.16,35.31 v10.16,26.67 | v15.24,20.32 15.24,19.05 16.51,17.78 19.68,17.78 21.36,16.11 U3.2
  Bottom 0.254: v15.24,20.32 15.24,22.86 11.43,26.67 v10.16,26.67
USB-RX  (via drill 0.51)
  Top 0.254: 6.03,36.84 S3.1 6.03,36.83 2.54,36.83 1.27,35.56 1.27,27.94 v2.54,26.67 | U3.1 22,14.7 22.54,15.24 22.86,15.56 v22.86,16.51
  Bottom 0.254: v22.86,16.51 21.59,17.78 17.78,17.78 16.51,16.51 6.99,16.51 2.54,20.95 v2.54,26.67
USB_D+
  Top 0.254: U3.15 13.55,8.04 10.16,11.43 JP4.D+
USB_D-
  Top 0.254: U3.16 14.21,8.65 10.63,12.23 JP4.D-
VBAT  (via drill 0.51)
  Top 0.254: v32.7,33.66 R6.1 | JP2.2 11.16,22.59 JP1.2 6.62,22.59 6.35,22.86 v6.35,25.4 2.54,29.21 2.54,31.75 3.77,32.98 S1.3
  Bottom 0.254: v32.7,33.66 27.94,28.89 27.94,25.4 26.04,23.5 20.32,23.5 15.88,27.94 8.89,27.94 v6.35,25.4
VCC  (via drill 0.51)
  Top 0.254: 9.53,62.87 C12.1 v9.53,60.96 | v9.53,60.96 9.53,61.59 | 17.06,37.23 17.14,37.15 17.14,36.2 17.71,35.63 U1.6 | R5.1 v34.29,44.45 45.72,44.45 | 45.72,44.45 45.72,45.72 | U5.3 44.45,27.3 41.27,27.3 40.62,26.66 C10.2 39.37,26.67 38.73,26.04 38.73,25.4 | 43.81,25.4 U5.4 40.64,25.4 40.01,24.77 C11.1 39.35,24.14 38.73,24.77 38.73,25.4 | v36.83,25.4 38.73,25.4 | 29.84,23.5 v29.84,25.4 29.84,30.48 | 29.84,30.48 29.84,32.37 C1.1 29.21,32.38 28.57,33.02 28.57,34.29 28.04,34.83 U1.18 | 17.06,37.23 U1.4 | 29.84,23.5 26.67,23.5 | 26.67,23.5 JP3.2 | 26.67,23.5 25.4,23.5 | 25.4,23.5 24.13,23.5 23.5,22.86 21.59,22.86 | 21.59,22.86 18.41,22.86 17.78,23.5 14.61,23.5 13.34,24.77 13.34,36.83 13.96,37.45 C2.1 16.84,37.45 17.06,37.23 | JP6-DNP.1 8.37,62.87 9.53,62.87 | 29.84,30.48 33.02,30.48 34.29,31.75 v34.29,40.64 33.66,41.27 R4.1 32.38,41.27 | R1.2 v15.88,3.81 | 29.84,23.5 29.84,12.8 31.85,10.79 39.37,10.79 | 39.37,10.79 U4.4 | v9.53,60.96 8.89,60.33 8.89,55.37 D9.1 | 26.04,54.61 26.04,53.34 25.4,52.7 R17.1 | 39.37,10.79 C9.1 | 26.04,54.61 D7.1 | D5.1 46.23,52.59 45.72,52.07 45.72,45.72 | 45.72,44.45 45.72,40.64 | 18.93,63.5 D11.1 | 18.93,63.5 25.4,63.5 26.04,62.87 26.04,54.61 | 9.53,62.87 10.79,62.87 11.43,63.5 18.93,63.5 | 45.72,45.72 JP7.5 | 45.72,40.64 JP7.3 | 45.72,40.64 R8.1 | U2.5 23.18,20.64 23.5,20.95 C7.A 25.4,20.95 25.4,23.5 | R3.2 21.61,22.88 21.59,22.86
  Bottom 0.254: v9.53,60.96 9.53,45.72 8.26,44.45 4.45,44.45 1.91,41.91 1.91,30.48 3.17,29.21 5.08,29.21 6.35,30.48 15.24,30.48 20.95,24.77 24.77,24.77 JP3.2 | JP6-DNP.1 2.54,60.21 JP8.1 | v15.88,3.81 17.78,3.81 29.84,15.88 v29.84,25.4 v36.83,25.4 | v34.29,40.64 v34.29,44.45
VRAW  (via drill 0.51)
  Top 0.254: v3.81,30.48 S1.2 6.99,30.48 7.62,29.84 7.62,27.3 9.53,25.4 11.75,25.4 15.88,21.27 C5.1 | C5.1 16.51,21.27 | C5.1 17.48,21.26 18.1,20.64 U2.1 | U2.3 16.82,18.73 16.51,19.05 C5.1
  Bottom 0.254: JP5-DNP.2 10.79,43.81 5.08,43.81 2.54,41.27 2.54,31.75 v3.81,30.48
VUSB
  Top 0.254: 6.03,27.98 S1.1 6.07,27.59 8.89,24.77 11.43,24.77 13.02,23.18 13.02,18.73 11.1,16.82 11.1,13.03 | U3.20 16.8,7.33 11.1,13.03 | JP4.VBUS 11.1,13.03
WDIR  (via drill 0.51)
  Top 0.254: v27.94,41.27 28.57,40.64 28.57,39.37 28.04,38.83 U1.23 | v26.04,50.8 24.13,50.8 23.48,51.45 R17.2 23.48,53.48 22.98,53.98 D7.2 22.98,55.37 23.18,55.56 23.81,55.56 25.08,55.56 25.28,55.76 D8.1 | D8.1 25.28,57.27 24.78,57.77 R13.1 | D8.1 25.4,56.52
  Bottom 0.254: v26.04,50.8 26.68,50.16 26.68,42.54 v27.94,41.27
WSPEED
  Top 0.254: U1.1 18.57,42.39 17.14,43.81 13.97,43.81 13.02,42.86 13.02,41.59 12.06,40.64 11.43,40.64 9.84,39.05 7.94,39.05 6.35,40.64 5.08,40.64 4.45,41.27 4.45,43.81 5.08,44.45 7.62,44.45 8.89,45.72 8.89,51.56 D9.2 | R14.1 10.14,57.77 9.64,57.27 D10.1 9.64,55.76 9.84,55.56 11.75,55.56 11.95,55.37 D9.2 | D9.2 11.94,54.61
XCLR  (via drill 0.51)
  Top 0.254: v49.85,25.4 U5.8 | U1.13 23.26,33.42 24.13,34.29 24.77,34.92 v25.4,34.92
  Bottom 0.254: v25.4,34.92 34.29,34.92 34.92,34.29 34.92,30.48 40.01,25.4 v49.85,25.4

### Text on the board
Bottom: 4-13-11
tPlace: Wind | Rain | XBee | BlueSMiRF | RF | Comm | USB | Light | BAT | Power | USB | + | 3.7-12V | RST | ISP | Pressure | - | Humidity | Status | Power | USB Weather V3
bPlace: 1 | 20 | 3.3V | 5 | 2 | GND | WIND | RAIN | SCL | SDA | 10 | 11 | CTS | VRAW | GND | RX-I | TX-O | BT-RTS | 3.3V | GND | 3.3V | GND | LIGHT | RST | SCK | MISO | GND | MOSI | 3.3V | BAT | GND
tValues: DNP | DNP | DNP | SMD Button | USB Weather Board v3 | R. Owens, M. Grusin
Document: 0.00" | 0.10" | 0.70" | 1.50" | 1.90" | 2.00" | 2.60" | 2.50" | 0.85" | 0.45" | 0.10" | 0.00"